# Altium schematic sheet S_R_Latch.SchDoc
size A3
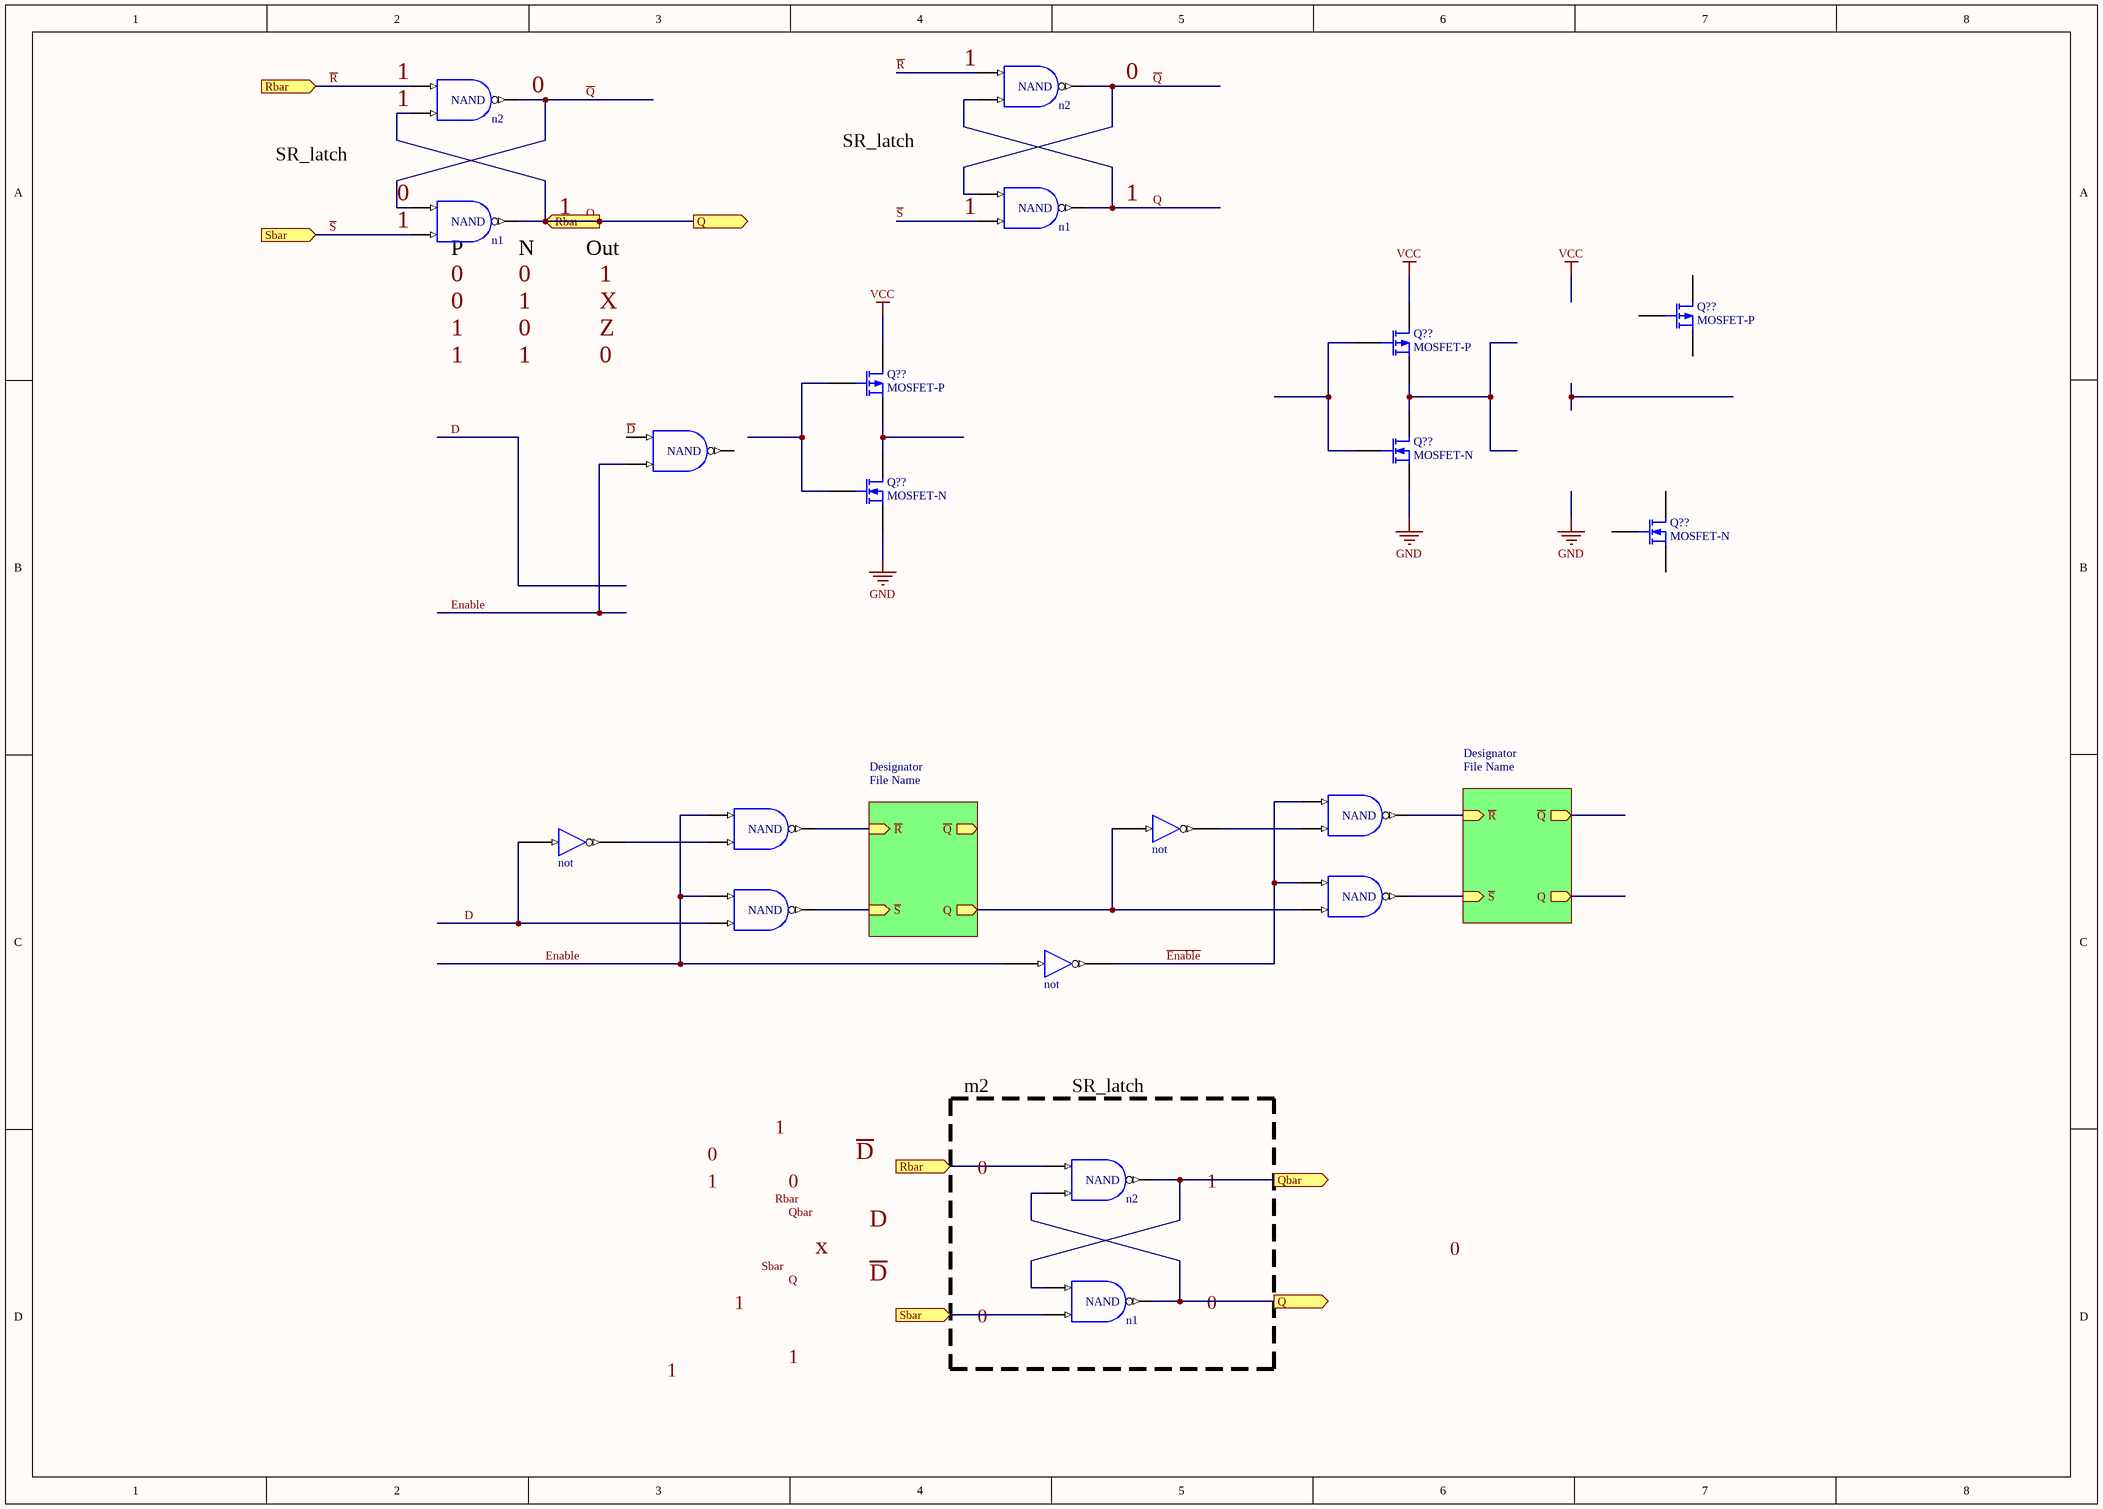
[diagram p0: S_R_Latch.SchDoc]

## Parts
(Parts that share a designator on the sheet are numbered #1, #2 ... from top to bottom, then left to right.)
n1#1  NAND
n1#2  NAND
n1#3  NAND
n2#1  NAND
n2#2  NAND
n2#3  NAND
Q??#1  MOSFET-P  [E3]
Q??#2  MOSFET-P  [E3]
Q??#3  MOSFET-P  [E3]
Q??#4  MOSFET-N  [E3]
Q??#5  MOSFET-N  [E3]
Q??#6  MOSFET-N  [E3]
U9#1  NAND
U9#2  NAND
U9#3  NAND
U10#1  NAND
U10#2  NAND
U16#1  not
U16#2  not
U17  not

## Sub-sheets
Designator = File Name: ~{Q} (out), Q (out), ~{R} (in), ~{S} (in)
Designator = File Name: ~{Q} (out), Q (out), ~{R} (in), ~{S} (in)

## Ports
Q (out), Qbar (out), Rbar (in), Sbar (in)

## Nets
GND: Q??#4.3(S) Q??#5.3(S)
VCC: Q??#2.1(D) Q??#3.1(D)
0: n1#1.A n1#2.A n2#1.Y n2#2.Y  [also labelled ~{Q}]
1: n1#1.B n1#1.Y n1#2.B n1#2.Y n1#3.B n1#3.Y n2#1.A n2#1.B n2#2.A n2#2.B n2#3.A n2#3.B ; port Q, port Rbar, port Sbar  [also labelled Q, ~{R}, ~{S}]
D: U10#2.B U16#2.I
~{D}: U9#1.A
~{Enable}: U9#2.A U10#1.A U17.O
Enable: U9#1.B U9#3.A U10#2.A U17.I
Qbar: n1#3.A n2#3.Y ; port Qbar
NetQ??#2_2: Q??#2.2(G) Q??#4.2(G)
NetQ??#2_3: Q??#2.3(S) Q??#4.1(D)
NetQ??#3_2: Q??#3.2(G) Q??#5.2(G)
NetQ??#3_3: Q??#3.3(S) Q??#5.1(D)
NetU9#2_B: U9#2.B U16#1.O
NetU9#2_Y: U9#2.Y ; sheet Designator/~{R}
NetU9#3_B: U9#3.B U16#2.O
NetU9#3_Y: U9#3.Y ; sheet Designator/~{R}
NetU10#1_B: U10#1.B U16#1.I ; sheet Designator/Q
NetU10#1_Y: U10#1.Y ; sheet Designator/~{S}
NetU10#2_Y: U10#2.Y ; sheet Designator/~{S}

Not connected (* = marked no-connect by the designer): Q??#1 1(D) 2(G) 3(S); Q??#6 1(D) 2(G) 3(S); U9#1 Y

## Notes on the sheet
- SR_latch
- (near n1#2) P
- (near n1#2) N
- Out
- m2
- Labels drawn without touching a wire or pin: 0, 1, D, Q, Qbar, Rbar, Sbar, x, X, Z, ~{D}

## Library data of the parts
n1#1-n1#3 n2#1-n2#3 U9#1-U9#3 U10#1 U10#2 = AND: 2 Input AND
Q??#1-Q??#3 = MOSFET-P: P-Channel MOSFET; Published: 8-Jun-2000; LatestRevisionDate: 17-Jul-2002; LatestRevisionNote: Re-released for DXP Platform.; PackageVersion: 1995/1996; PackageReference: E3; Publisher: Altium Limited; PackageDescription: TO, Flat Index; 3 In-Line, Axial Leads; Body Dia. 4.6mm; Lead Dia. 0.5 mm (max)
Q??#4-Q??#6 = MOSFET-N: N-Channel MOSFET; Published: 8-Jun-2000; LatestRevisionDate: 17-Jul-2002; LatestRevisionNote: Re-released for DXP Platform.; PackageVersion: 1995/1996; PackageReference: E3; Publisher: Altium Limited; PackageDescription: TO, Flat Index; 3 In-Line, Axial Leads; Body Dia. 4.6mm; Lead Dia. 0.5 mm (max)
U16#1 U16#2 U17 = BUF: 1-bit General Purpose (Non-inverting) Buffer